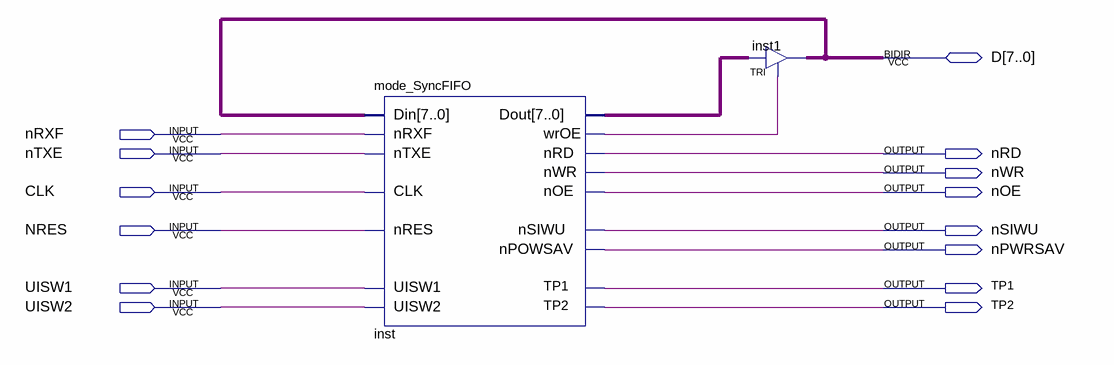
[diagram p0: schematic sheet]
// Quartus schematic testFT232H.bdf as structural Verilog: 2 symbols, 14 pins
module testFT232H (
  input  nRXF,
  input  nTXE,
  input  CLK,
  input  NRES,
  input  UISW1,
  input  UISW2,
  inout  [7:0] D,
  output nRD,
  output nWR,
  output nOE,
  output nSIWU,
  output nPWRSAV,
  output TP1,
  output TP2
);

  wire inst_wroe;
  wire [7:0] inst_dout;

  mode_SyncFIFO inst (
    .Din(D), .CLK(CLK), .nRES(NRES), .UISW2(UISW2), .UISW1(UISW1), .nRXF(nRXF), .nTXE(nTXE),
    .Dout(inst_dout), .nRD(nRD), .nWR(nWR), .nSIWU(nSIWU), .nOE(nOE), .wrOE(inst_wroe), .nPOWSAV(nPWRSAV),
    .TP1(TP1), .TP2(TP2));
  TRI inst1[7:0] (.IN(inst_dout), .OE(inst_wroe), .OUT(D));
endmodule
